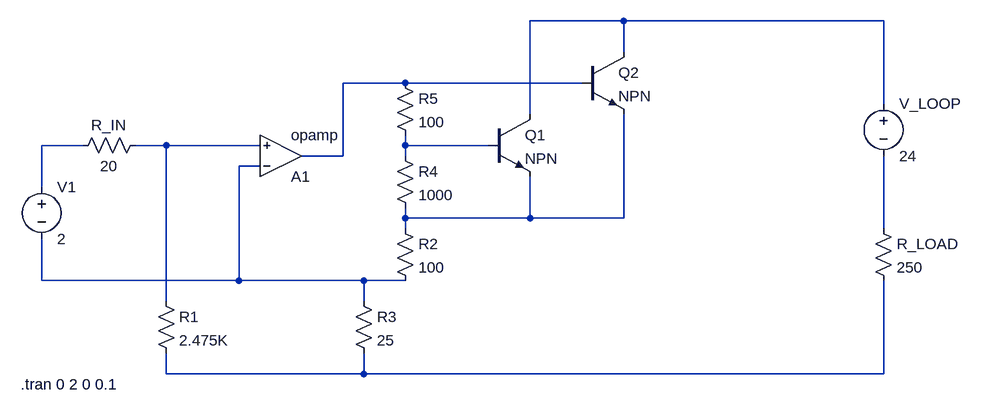
[diagram p0: schematic XTR116.asc]
XTR116.asc, the LTspice schematic file:
Version 4.1
SHEET 1 1416 680
WIRE 864 -512 720 -512
WIRE 1264 -512 864 -512
WIRE 864 -464 864 -512
WIRE 528 -416 432 -416
WIRE 800 -416 528 -416
WIRE 1264 -384 1264 -512
WIRE 720 -368 720 -512
WIRE 32 -320 -32 -320
WIRE 160 -320 112 -320
WIRE 304 -320 160 -320
WIRE 528 -320 528 -336
WIRE 656 -320 528 -320
WIRE 432 -304 432 -416
WIRE 432 -304 368 -304
WIRE 528 -304 528 -320
WIRE 304 -288 272 -288
WIRE -32 -256 -32 -320
WIRE 528 -208 528 -224
WIRE 720 -208 720 -272
WIRE 720 -208 528 -208
WIRE 864 -208 864 -368
WIRE 864 -208 720 -208
WIRE 528 -192 528 -208
WIRE 1264 -192 1264 -304
WIRE -32 -112 -32 -176
WIRE 272 -112 272 -288
WIRE 272 -112 -32 -112
WIRE 464 -112 272 -112
WIRE 528 -112 464 -112
WIRE 160 -80 160 -320
WIRE 464 -80 464 -112
WIRE 160 32 160 0
WIRE 464 32 464 0
WIRE 464 32 160 32
WIRE 1264 32 1264 -112
WIRE 1264 32 464 32
SYMBOL OpAmps\\opamp 336 -240 M180
SYMATTR InstName A1
SYMBOL res 128 -336 R90
WINDOW 0 0 56 VBottom 2
WINDOW 3 32 56 VTop 2
SYMATTR InstName R_IN
SYMATTR Value 20
SYMBOL res 144 -96 R0
SYMATTR InstName R1
SYMATTR Value 2.475K
SYMBOL res 448 -96 R0
SYMATTR InstName R3
SYMATTR Value 25
SYMBOL voltage -32 -272 R0
WINDOW 123 0 0 Left 0
WINDOW 39 0 0 Left 0
SYMATTR InstName V1
SYMATTR Value 2
SYMBOL res 512 -208 R0
SYMATTR InstName R2
SYMATTR Value 100
SYMBOL res 512 -320 R0
SYMATTR InstName R4
SYMATTR Value 1000
SYMBOL res 512 -432 R0
SYMATTR InstName R5
SYMATTR Value 100
SYMBOL npn 656 -368 R0
SYMATTR InstName Q1
SYMBOL npn 800 -464 R0
SYMATTR InstName Q2
SYMBOL voltage 1264 -400 R0
WINDOW 123 0 0 Left 0
WINDOW 39 0 0 Left 0
SYMATTR InstName V_LOOP
SYMATTR Value 24
SYMBOL res 1248 -208 R0
SYMATTR InstName R_LOAD
SYMATTR Value 250
TEXT -64 48 Left 2 !.tran 0 2 0 0.1

The netlist it stands for:
* XTR116.asc
X§A1 N006 N004 N002 opamp Aol=100K GBW=10Meg  ; pins invin noninvin out
R_IN N004 N003 20
R1 N004 N009 2.475K
R3 N006 N009 25
V1 N003 N006 2
R2 N007 N006 100
R4 N005 N007 1000
R5 N002 N005 100
Q1 N001 N005 N007 0 NPN
Q2 N001 N002 N007 0 NPN
V_LOOP N001 N008 24
R_LOAD N008 N009 250
.model NPN NPN
.model PNP PNP
.lib standard.bjt
.tran 0 2 0 0.1
.backanno
.end